# Altium project Modulator.PrjPCB (part 4 of 4)

## Sheet DIOT_Connectors.SchDoc: HVPSU_ISOL
size 420 x 297 mm; Project: HVPSU_ISOL.PrjPCB; Author: G.Kasprowicz; CompanyName: WUT ISE; DrawnBy: G.Kasprowicz; Organization: WUT ISE; Address1: PW ISE; Address2: Nowowiejska 15/19 00-665 Warsaw; Address3: gkasprow@gmail.com; Revision: 1; SheetNumber: -; SheetTotal: -; ModifiedBy: -; CheckedDate: -; Title2: DIOT Connectors; DivGrp: WUT ISE; Designer: G.Kasprowicz; ModifiedDate: -; ProjectName: Sensor Box
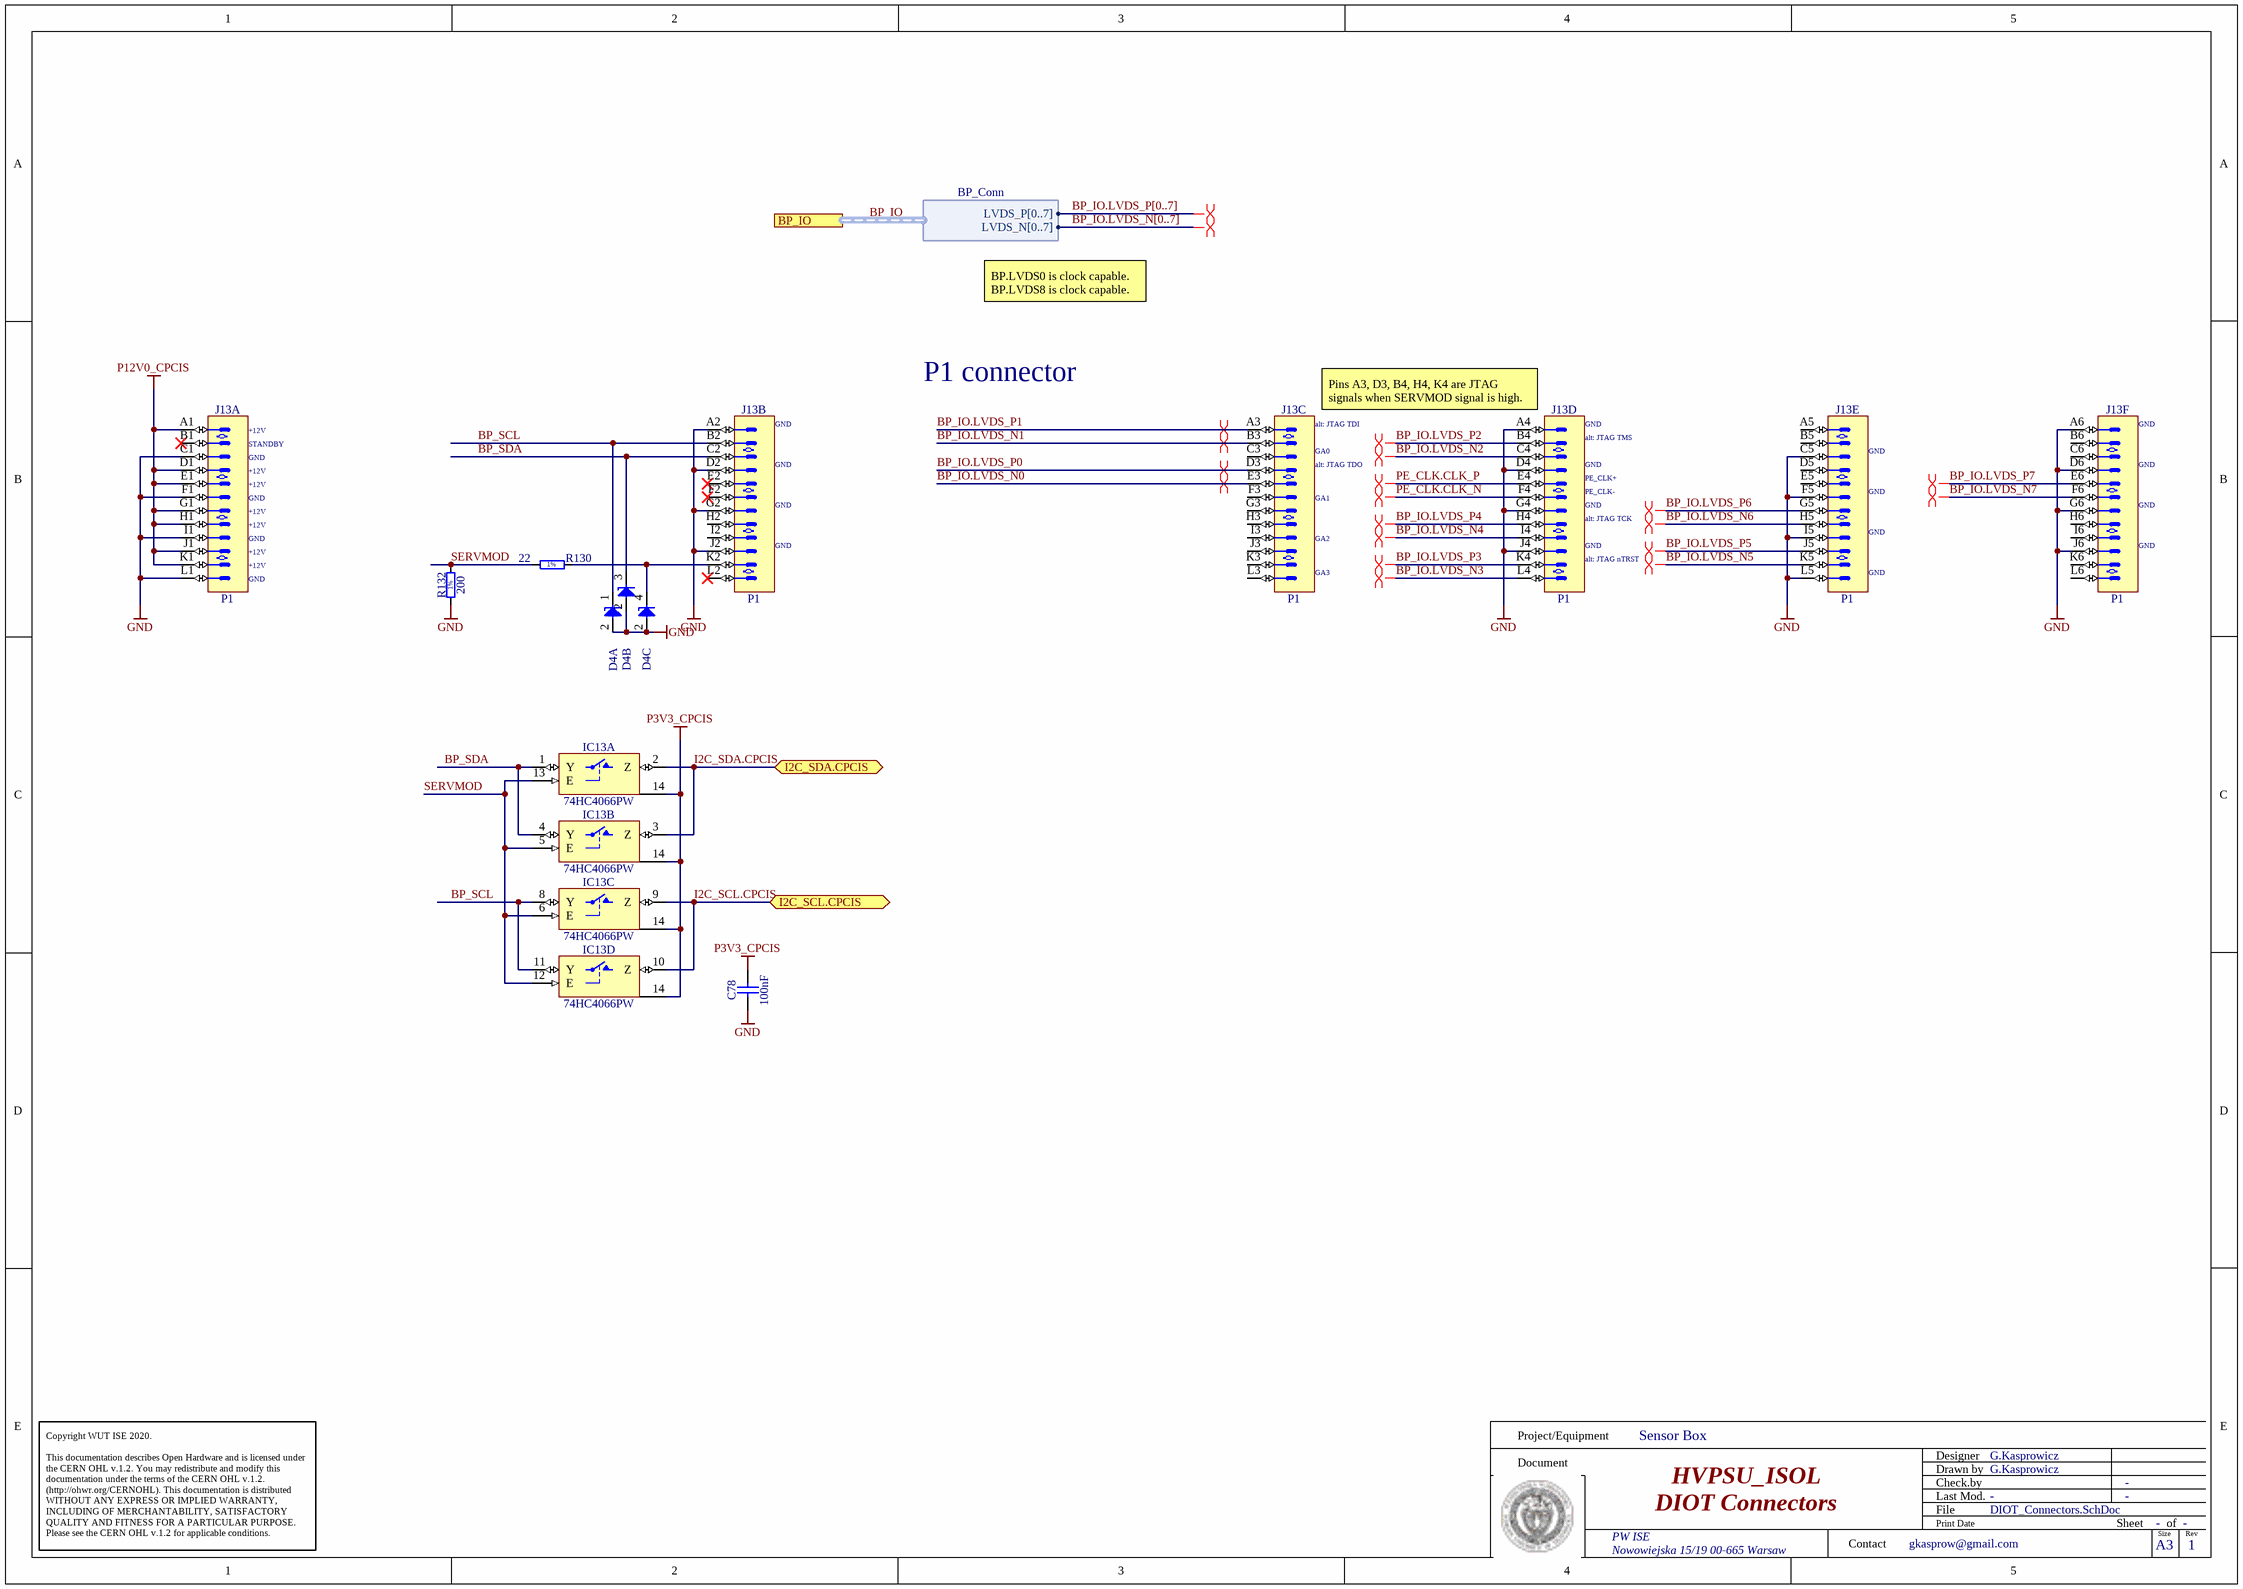
[diagram p6: DIOT_Connectors.SchDoc]

### Parts
C78  100nF  [CAPC1005X55N]
D4  PESD3V3L5UY  [SOT65P210X110-6N]  (value not drawn)  (parts A,B,C of 5)
IC13  74HC4066PW  [SOP65P640X110-14N]  (parts A,B,C,D of 4)
J13  P1  [AMPHENOL_10052825-101LF]  (parts A,B,C,D,E,F of 6)
R130  22  [RESC1005X40N]
R132  200  [RESC1005X40N]

### Ports
BP_IO (harness BP_Conn), I2C_SCL.CPCIS (bidir), I2C_SDA.CPCIS (bidir)

### Harnesses
BP_Conn: LVDS_P[0..7], LVDS_N[0..7]

### Nets
GND: C78.1 D4.2(A) IC13.7(GND) J13.A2 J13.A4 J13.A6 J13.C1 J13.C5 J13.D2 J13.D4 J13.D6 J13.F1 J13.F5 J13.G2 J13.G4 J13.G6 J13.I1 J13.I5 J13.J2 J13.J4 J13.J6 J13.L1 J13.L5 R132.1
P3V3_CPCIS: C78.2 IC13.14(VCC)
P12V0_CPCIS: J13.A1 J13.D1 J13.E1 J13.G1 J13.H1 J13.J1 J13.K1
BP_IO.LVDS_N0: J13.E3
BP_IO.LVDS_N1: J13.B3
BP_IO.LVDS_N2: J13.C4
BP_IO.LVDS_N3: J13.L4
BP_IO.LVDS_N4: J13.I4
BP_IO.LVDS_N5: J13.K5
BP_IO.LVDS_N6: J13.H5
BP_IO.LVDS_N7: J13.F6
BP_IO.LVDS_P0: J13.D3
BP_IO.LVDS_P1: J13.A3
BP_IO.LVDS_P2: J13.B4
BP_IO.LVDS_P3: J13.K4
BP_IO.LVDS_P4: J13.H4
BP_IO.LVDS_P5: J13.J5
BP_IO.LVDS_P6: J13.G5
BP_IO.LVDS_P7: J13.E6
BP_SCL: D4.1(C) IC13.8(Y) IC13.11(Y) J13.B2
BP_SDA: D4.3(C) IC13.1(Y) IC13.4(Y) J13.C2
I2C_SCL.CPCIS: IC13.9(Z) IC13.10(Z) ; port I2C_SCL.CPCIS
I2C_SDA.CPCIS: IC13.2(Z) IC13.3(Z) ; port I2C_SDA.CPCIS
PE_CLK.CLK_N: J13.F4
PE_CLK.CLK_P: J13.E4
SERVMOD: IC13.5(E) IC13.6(E) IC13.12(E) IC13.13(E) R130.1 R132.2
NetD4_4: D4.4(C) J13.K2 R130.2

Not connected (* = marked no-connect by the designer): J13 A5 B1* B5 B6 C3 C6 D5 E2* E5 F2* F3 G3 H2 H3 H6 I2 I3 I6 J3 K3 K6 L2* L3 L6

### Buses and harness runs
bus BP_IO.LVDS_N[0..7]
bus BP_IO.LVDS_P[0..7]
harness BP_IO = port BP_IO

### Layout directives
differential pair: (no net found under the mark), BP_IO.LVDS_N0, BP_IO.LVDS_N1, BP_IO.LVDS_N2, BP_IO.LVDS_N3, BP_IO.LVDS_N4, BP_IO.LVDS_N5, BP_IO.LVDS_N6, BP_IO.LVDS_N7, BP_IO.LVDS_P0, BP_IO.LVDS_P1, BP_IO.LVDS_P2, BP_IO.LVDS_P3, BP_IO.LVDS_P4, BP_IO.LVDS_P5, BP_IO.LVDS_P6, BP_IO.LVDS_P7, PE_CLK.CLK_N, PE_CLK.CLK_P

### Notes on the sheet
- BP.LVDS0 is clock capable.
  BP.LVDS8 is clock capable.
- P1 connector
- (near J13) +12V
- (near J13) STANDBY
- (near J13) GND
- (near J13) alt: JTAG TDI
- (near J13) GA0
- (near J13) Pins A3, D3, B4, H4, K4 are JTAG signals when SERVMOD signal is high.
- (near J13) alt: JTAG TMS
- (near J13) alt: JTAG TDO
- (near J13) GA1
- (near J13) alt: JTAG TCK
- (near J13) PE_CLK+
- (near J13) PE_CLK-
- (near J13) GA2
- (near J13) GA3
- (near J13) alt: JTAG nTRST
- Project/Equipment
- Document
- Designer
- Drawn by
- Check.by
- Copyright WUT ISE 2020.
  This documentation describes Open Hardware and is licensed under the CERN OHL v.1.2. You may redistribute and modify this documentation under the terms of the CERN OHL v.1.2. (http://ohwr.org/CERNOHL). This documentation is distributed WITHOUT ANY EXPRESS OR IMPLIED WARRANTY, INCLUDING OF MERCHANTABILITY, SATISFACTORY QUALITY AND FITNESS FOR A PARTICULAR PURPOSE. Please see the CERN OHL v.1.2 for applicable conditions.
- Contact
- File
- Last Mod.
- Print Date
- Sheet
- Size
- A3
- of
- Rev
- (in symbol R0402_22R_1%_0.0625W_100PPM) 1%
- (in symbol R0402_200R_1%_0.0625W_100PPM) 1%

### Library data of the parts
C78 = CC0402_100NF_16V_10%_X5R: Non-polarised capacitor; Part Description: SMD Multilayer Chip Ceramic Capacitor; Manufacturer: GENERIC; Manufacturer1 Part Number: GRM155R61C104KA88D; Voltage: 16V; TC: X5R; Tolerance: ±10%; Part Number: CC0402_100NF_16V_10%_X5R; Component Kind: Standard; Component Type: Standard; Pin Count: 2; Value: 100nF; Status: None; Manufacturer Part Number: CC0402_100NF_16V_10%_X5R; Case: 0402; Mounted: Yes; Socket: No; SMD: Yes; Sense: No; Manufacturer1 Example: MURATA; Manufacturer1 ComponentHeight: 0.55mm; HelpURL: \\cern.ch\dfs\Applications\Altium\Datasheets\CC0402_X5R_MURATA_GRM.pdf; Author: CERN DEM JLC; CreateDate: 10.12.2013; LatestRevisionDate: 10.12.2013
D4 = PESD3V3L5UY: Fivefold ESD Protection Diode Arrays; Part Description: Fivefold ESD Protection Diode Arrays (30kV); Manufacturer: NEXPERIA; Voltage: 3.3V; Power: 200W; PressFit: No; Bonding: No; Part Number: PESD3V3L5UY; Component Kind: Standard; Component Type: Standard; Device: PESD3V3L5UY; PackageDescription: SOT363, SC-88, 0.65mm Pitch; 6 Pin, 1.25mm W X 2.00mm L X 1.10mm H body, IPC Medium Density; Manufacturer Part Number: PESD3V3L5UY; Pin Count: 6; Case: SOT363; Mounted: Yes; Socket: No; SMD: Yes; Sense: No; ComponentHeight: 1.1mm; HelpURL: \\cern.ch\dfs\Applications\Altium\Datasheets\PESD3V3L5UY.pdf; Author: CERN DEM WB; CreateDate: 05.07.2021; LatestRevisionDate: 05.07.2021
IC13 = 74HC4066PW: Part Description: Quad Single-Pole Single-Throw Analog Switch; Manufacturer: NXP SEMICONDUCTORS; PressFit: No; Bonding: No; Part Number: 74HC4066PW; Component Kind: Standard; Component Type: Standard; Device: 74HC4066PW; PackageDescription: SOP, 14-Leads, Body 4.4x5mm (max), Pitch 0.65mm, IPC Medium Density; Manufacturer Part Number: 74HC4066PW; Pin Count: 14; Case: TSSOP14; Mounted: Yes; Socket: No; SMD: Yes; Sense: No; ComponentHeight: 1.1mm; Author: CERN DEM JLC; HelpURL: \\cern.ch\dfs\Applications\Altium\Datasheets\74HC4066PW.pdf; CreateDate: 19.11.2014; LatestRevisionDate: 19.11.2014
J13 = AMPHENOL_10052825-101LF: 72 Contacts Header, 6 Columns, 4 Pairs per Column; Part Description: 72 Contacts, 2mm Pitch, 6 Columns, 4 Pairs per Column, 4 Walls, Right Angle Header; Part Number: AMPHENOL_10052825-101LF; Component Kind: Standard; Component Type: Standard; Pin Count: 72; Family: AirMax VS; Mounted: Yes; Socket: No; SMD: No; PressFit: Yes; Sense: No; Status: None; Manufacturer: AMPHENOL; Manufacturer Part Number: 10052825-101LF; ComponentHeight: 15.35mm; HelpURL: \\cern.ch\dfs\Applications\Altium\Datasheets\AMPHENOL_10052825-101LF.pdf; ComponentLink1URL: \\cern.ch\dfs\Applications\Altium\Datasheets\AMPHENOL_10052825-101LF_Application.pdf; ComponentLink1Description: Application; Author: CERN DEM MR; CreateDate: 19/02/2018; LatestRevisionDate: 19/02/2018; Classname: Overlapping
R130 = R0402_22R_1%_0.0625W_100PPM: Resistor - 1%; Part Description: General Purpose Thick Film Chip Resistor; Manufacturer: GENERIC; Manufacturer1 Part Number: 232270672209L; TC: ±100ppm/°C; PressFit: No; Part Number: R0402_22R_1%_0.0625W_100PPM; Component Kind: Standard; Component Type: Standard; Pin Count: 2; Value: 22; Status: Not Recommended; Power: 0.0625W; Tolerance: ±1%; Manufacturer Part Number: R0402_22R_1%_0.0625W_100PPM; Case: 0402; Mounted: Yes; Socket: No; SMD: Yes; Manufacturer1 Example: YAGEO PHYCOMP; Manufacturer1 ComponentHeight: 0.4mm; HelpURL: \\cern.ch\dfs\Applications\Altium\Datasheets\R0402_Phycomp_RC0402.pdf; Author: CERN DEM JLC; CreateDate: 03.12.2007; LatestRevisionDate: 17.10.2012; Sense: No
R132 = R0402_200R_1%_0.0625W_100PPM: Resistor - 1%; Part Description: General Purpose Thick Film Chip Resistor; Manufacturer: GENERIC; Manufacturer1 Part Number: 232270672001L; TC: ±100ppm/°C; PressFit: No; Part Number: R0402_200R_1%_0.0625W_100PPM; Component Kind: Standard; Component Type: Standard; Pin Count: 2; Value: 200; Status: Not Recommended; Power: 0.0625W; Tolerance: ±1%; Manufacturer Part Number: R0402_200R_1%_0.0625W_100PPM; Case: 0402; Mounted: Yes; Sense: No; Socket: No; SMD: Yes; Manufacturer1 Example: YAGEO PHYCOMP; Manufacturer1 ComponentHeight: 0.4mm; HelpURL: \\cern.ch\dfs\Applications\Altium\Datasheets\R0402_Phycomp_RC0402.pdf; Author: CERN DEM JLC; CreateDate: 2007-12-03; LatestRevisionDate: 2012-10-17

## Nets that join several sheets
GND: Modulator (47 pins), LVDS_IFC_VCO (45 pins), Supply_Modulator (90 pins), M1 (7 pins), M1/IN1 (10 pins), M1/IN2 (10 pins), M1/IN3 (10 pins), M1/OUT1 (32 pins), M2 (7 pins), M2/IN1 (10 pins), M2/IN2 (10 pins), M2/IN3 (10 pins), M2/OUT1 (32 pins), DIOT_Connectors (24 pins)
N2V5: M1 (L8A.1), M1/IN1 (L2A.2), M1/IN2 (L2B.2), M1/IN3 (L2C.2), M1/OUT1 (L9A.2), M2 (L8B.1), M2/IN1 (L2D.2), M2/IN2 (L2E.2), M2/IN3 (L2F.2), M2/OUT1 (L9B.2)
N7V5A: Supply_Modulator (8 pins), M1/OUT1 (C41A.2 L15A.2), M2/OUT1 (C41B.2 L15B.2)
P2V5: M1 (L7A.2 R32A.1), M1/IN1 (L1A.2), M1/IN2 (L1B.2), M1/IN3 (L1C.2), M1/OUT1 (L3A.2), M2 (L7B.2 R32B.1), M2/IN1 (L1D.2), M2/IN2 (L1E.2), M2/IN3 (L1F.2), M2/OUT1 (L3B.2)
P3V3_CPCIS: LVDS_IFC_VCO (R113.2), DIOT_Connectors (C78.2 IC13.14)
P3V3_MP: LVDS_IFC_VCO (6 pins), Supply_Modulator (8 pins)
P7V5A: Supply_Modulator (8 pins), M1/OUT1 (C114A.2 L13A.2 SW3A.1), M2/OUT1 (C114B.2 L13B.2 SW3B.1)
P12V0: LVDS_IFC_VCO (J1.28 J1.29 R114.1), Supply_Modulator (17 pins)
P12V0_CPCIS: LVDS_IFC_VCO (R114.2), DIOT_Connectors (7 pins)
VDD: Modulator (10 pins), LVDS_IFC_VCO (26 pins), Supply_Modulator (9 pins), M1/OUT1 (C35A.2 C36A.2 IC11A.5 R72A.2), M2/OUT1 (C35B.2 C36B.2 IC11B.5 R72B.2)
BP_IO.LVDS_N0: LVDS_IFC_VCO (R70.2), DIOT_Connectors (J13.E3)
BP_IO.LVDS_N1: LVDS_IFC_VCO (R87.2), DIOT_Connectors (J13.B3)
BP_IO.LVDS_N2: LVDS_IFC_VCO (R98.2), DIOT_Connectors (J13.C4)
BP_IO.LVDS_N3: LVDS_IFC_VCO (R101.2), DIOT_Connectors (J13.L4)
BP_IO.LVDS_N4: LVDS_IFC_VCO (R103.2), DIOT_Connectors (J13.I4)
BP_IO.LVDS_N5: LVDS_IFC_VCO (R107.2), DIOT_Connectors (J13.K5)
BP_IO.LVDS_N6: LVDS_IFC_VCO (R109.2), DIOT_Connectors (J13.H5)
BP_IO.LVDS_N7: LVDS_IFC_VCO (R112.2), DIOT_Connectors (J13.F6)
BP_IO.LVDS_P0: LVDS_IFC_VCO (R61.2), DIOT_Connectors (J13.D3)
BP_IO.LVDS_P1: LVDS_IFC_VCO (R86.2), DIOT_Connectors (J13.A3)
BP_IO.LVDS_P2: LVDS_IFC_VCO (R95.2), DIOT_Connectors (J13.B4)
BP_IO.LVDS_P3: LVDS_IFC_VCO (R100.2), DIOT_Connectors (J13.K4)
BP_IO.LVDS_P4: LVDS_IFC_VCO (R102.2), DIOT_Connectors (J13.H4)
BP_IO.LVDS_P5: LVDS_IFC_VCO (R105.2), DIOT_Connectors (J13.J5)
BP_IO.LVDS_P6: LVDS_IFC_VCO (R108.2), DIOT_Connectors (J13.G5)
BP_IO.LVDS_P7: LVDS_IFC_VCO (R111.2), DIOT_Connectors (J13.E6)
CM_M1: M1 (C20A.2 IC5A.16), M1/IN1 (C53A.2 IC2A.9), M1/IN2 (C53B.2 IC2B.9), M1/IN3 (C53C.2 IC2C.9)
CM_M2: M2 (C20B.2 IC5B.16), M2/IN1 (C53D.2 IC2D.9), M2/IN2 (C53E.2 IC2E.9), M2/IN3 (C53F.2 IC2F.9)
I2C_SCL: LVDS_IFC_VCO (5 pins), Supply_Modulator (R125.1)
I2C_SCL.CPCIS: LVDS_IFC_VCO (R118.2), DIOT_Connectors (IC13.9 IC13.10)
I2C_SDA: LVDS_IFC_VCO (5 pins), Supply_Modulator (R124.1)
I2C_SDA.CPCIS: LVDS_IFC_VCO (R117.2), DIOT_Connectors (IC13.2 IC13.3)
MX_IN_X_N_M1: M1 (IC5A.14), M1/IN3 (R6C.2 R10C.2)
MX_IN_X_N_M2: M2 (IC5B.14), M2/IN3 (R6F.2 R10F.2)
MX_IN_X_P_M1: M1 (IC5A.13), M1/IN3 (R3C.2 R20C.2)
MX_IN_X_P_M2: M2 (IC5B.13), M2/IN3 (R3F.2 R20F.2)
MX_IN_Y_N_M1: M1 (IC5A.12), M1/IN2 (R6B.2 R10B.2)
MX_IN_Y_N_M2: M2 (IC5B.12), M2/IN2 (R6E.2 R10E.2)
MX_IN_Y_P_M1: M1 (IC5A.11), M1/IN2 (R3B.2 R20B.2)
MX_IN_Y_P_M2: M2 (IC5B.11), M2/IN2 (R3E.2 R20E.2)
MX_IN_Z_N_M1: M1 (IC5A.9), M1/IN1 (R3A.2 R20A.2)
MX_IN_Z_N_M2: M2 (IC5B.9), M2/IN1 (R3D.2 R20D.2)
MX_IN_Z_P_M1: M1 (IC5A.10), M1/IN1 (R6A.2 R10A.2)
MX_IN_Z_P_M2: M2 (IC5B.10), M2/IN1 (R6D.2 R10D.2)
MX_OUT_W_N_M1: M1 (IC5A.6), M1/OUT1 (R15A.1 R39A.1)
MX_OUT_W_N_M2: M2 (IC5B.6), M2/OUT1 (R15B.1 R39B.1)
MX_OUT_W_P_M1: M1 (IC5A.5), M1/OUT1 (R15A.2 R34A.1)
MX_OUT_W_P_M2: M2 (IC5B.5), M2/OUT1 (R15B.2 R34B.1)
NetC11A_1: M1 (R58A#1.1 R77A.2), M1/IN1 (C11A.1 R81A.1)
NetC11B_1: M1 (R79A.1 R80A.2), M1/IN2 (C11B.1 R81B.1)
NetC11C_1: Modulator (J7.1), M1/IN3 (C11C.1 R81C.1)
NetC11D_1: M2 (R58B#1.1 R77B.2), M2/IN1 (C11D.1 R81D.1)
NetC11E_1: M2 (R79B.1 R80B.2), M2/IN2 (C11E.1 R81E.1)
NetC11F_1: Modulator (J9.1), M2/IN3 (C11F.1 R81F.1)
NetIC1_20: Modulator (R83.2 R84.2), LVDS_IFC_VCO (8 pins)
NetIC1_25: Modulator (TP4.1), LVDS_IFC_VCO (IC1.25 IC1.26)
NetIC1_28: Modulator (TP3.1), LVDS_IFC_VCO (IC1.28 IC1.29)
NetIC1_32: Modulator (TP2.1), LVDS_IFC_VCO (IC1.32 IC1.33)
NetIC6_25: Modulator (TP9.1), LVDS_IFC_VCO (IC6.25 IC6.26)
NetIC6_28: Modulator (TP8.1), LVDS_IFC_VCO (IC6.28 IC6.29)
NetIC6_32: Modulator (TP6.1), LVDS_IFC_VCO (IC6.32 IC6.33)
NetIC6_35: Modulator (TP5.1), LVDS_IFC_VCO (IC6.35 IC6.36)
NetJ2_1: Modulator (J2.1), M1 (R23A.1 R56A#1.1)
NetJ3_1: Modulator (J3.1), M1 (R22A.1 R78A.1)
NetJ4_1: Modulator (J4.1), M1 (R31A.1)
NetJ5_1: Modulator (J5.1), M1/OUT1 (R62A.2 R71A.2)
NetJ6_1: Modulator (J6.1), M2 (R31B.1)
NetJ8_1: Modulator (J8.1), M2 (R23B.1 R56B#1.1)
NetJ10_1: Modulator (J10.1), M2 (R22B.1 R78B.1)
NetJ11_1: Modulator (J11.1), M2/OUT1 (R62B.2 R71B.2)
PGOOD: Modulator (R99.1 TP1.1), LVDS_IFC_VCO (IC1.35 IC1.36), Supply_Modulator (IC16.4 IC19.7 IC201.3 IC202.4)
~{RE}_DE0: Modulator (R26.2 R60.2), LVDS_IFC_VCO (IC1.1 IC1.40)
~{RE}_DE1: Modulator (R27.2 R64.2), LVDS_IFC_VCO (IC1.5 IC1.42)
~{RE}_DE2: Modulator (R28.2 R65.2), LVDS_IFC_VCO (IC1.8 IC1.19)
~{RE}_DE3: Modulator (R29.2 R66.2), LVDS_IFC_VCO (IC1.12 IC1.21)
~{RE}_DE4: Modulator (R30.2 R67.2), LVDS_IFC_VCO (IC6.1 IC6.40)
~{RE}_DE5: Modulator (R43.2 R69.2), LVDS_IFC_VCO (IC6.5 IC6.42)
~{RE}_DE6: Modulator (R44.2 R75.2), LVDS_IFC_VCO (IC6.8 IC6.19)
~{RE}_DE7: Modulator (R74.2 R76.2), LVDS_IFC_VCO (IC6.12 IC6.21)

## Assembly variants
default: not fitted C11A C11B C11C C11D C11E C11F R3A R3B R3C R3D R3E R3F R6A R6B R6C R6D R6E R6F R15A R15B R17A R17B R27 R28 R29 R30 R36A R36B R37A R37B R40A R40B R43 R44 R54A R54B R60 R61A R61B R62A R62B R70A R70B R71A R71B R74